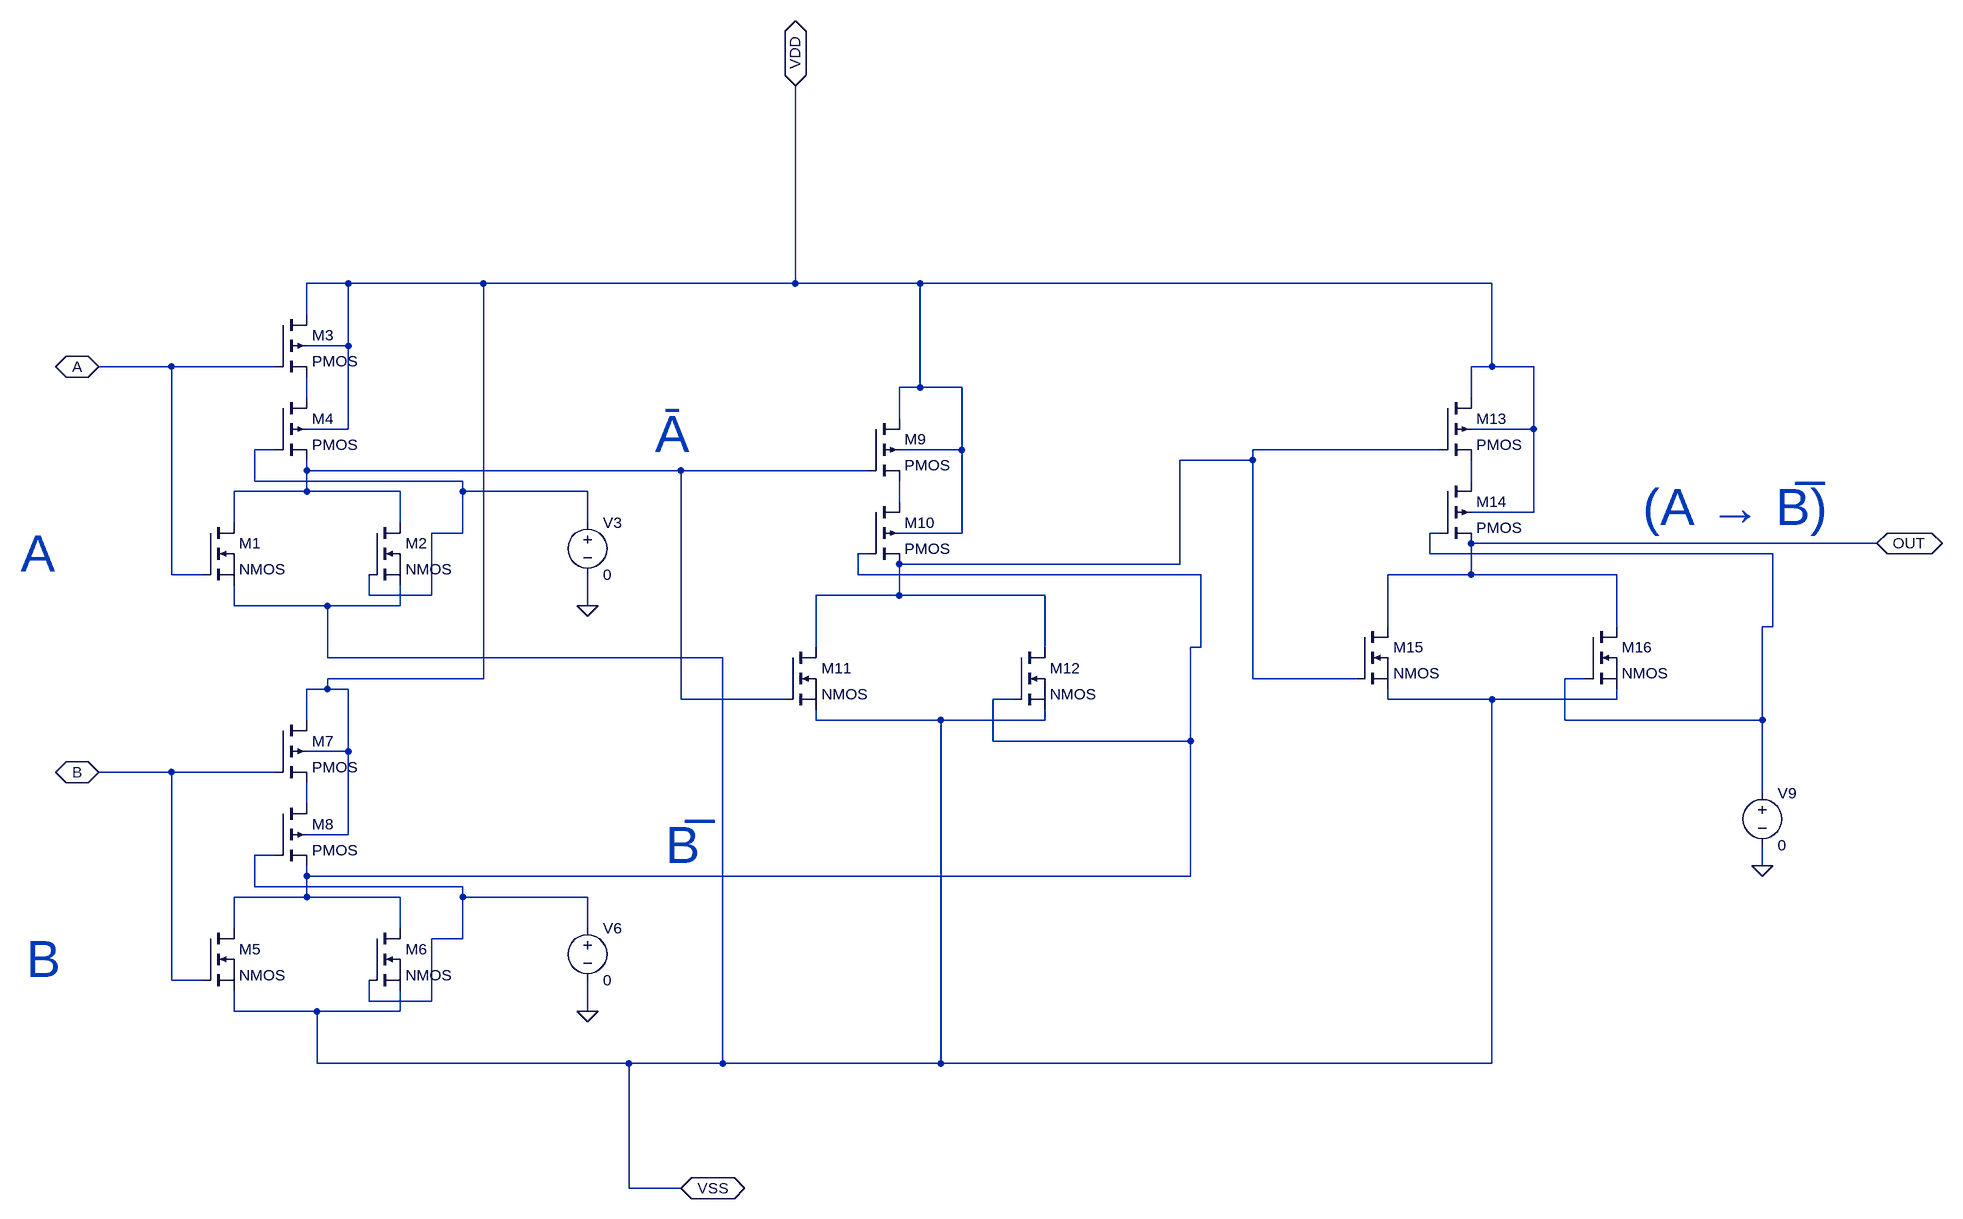
[diagram p0: schematic nandgateimply.asc]
nandgateimply.asc, the LTspice schematic file:
Version 4
SHEET 1 1692 1080
WIRE -768 -384 -832 -384
WIRE -560 -384 -768 -384
WIRE -80 -384 -80 -688
WIRE -80 -384 -560 -384
WIRE 112 -384 -80 -384
WIRE 992 -384 112 -384
WIRE -832 -336 -832 -384
WIRE -768 -288 -768 -384
WIRE -768 -288 -832 -288
WIRE -1040 -256 -1152 -256
WIRE -880 -256 -1040 -256
WIRE 992 -256 992 -384
WIRE 992 -256 960 -256
WIRE 1056 -256 992 -256
WIRE 112 -224 112 -384
WIRE 112 -224 80 -224
WIRE 176 -224 112 -224
WIRE -832 -208 -832 -240
WIRE 960 -208 960 -256
WIRE 80 -176 80 -224
WIRE -768 -160 -768 -288
WIRE -768 -160 -832 -160
WIRE 1056 -160 1056 -256
WIRE 1056 -160 960 -160
WIRE -880 -128 -912 -128
WIRE 176 -128 176 -224
WIRE 176 -128 80 -128
WIRE 912 -128 624 -128
WIRE 624 -112 624 -128
WIRE 624 -112 512 -112
WIRE -832 -96 -832 -112
WIRE -256 -96 -832 -96
WIRE 32 -96 -256 -96
WIRE -912 -80 -912 -128
WIRE -592 -80 -912 -80
WIRE 960 -80 960 -112
WIRE -832 -64 -832 -96
WIRE -832 -64 -944 -64
WIRE -688 -64 -832 -64
WIRE -592 -64 -592 -80
WIRE -400 -64 -592 -64
WIRE 80 -48 80 -80
WIRE 1056 -32 1056 -160
WIRE 1056 -32 960 -32
WIRE -944 -16 -944 -64
WIRE -688 -16 -688 -64
WIRE -400 -16 -400 -64
WIRE -592 0 -592 -64
WIRE -592 0 -640 0
WIRE 176 0 176 -128
WIRE 176 0 80 0
WIRE 912 0 896 0
WIRE 1584 16 960 16
WIRE 32 32 16 32
WIRE 896 32 896 0
WIRE 1424 32 896 32
WIRE 512 48 512 -112
WIRE 512 48 80 48
WIRE -1040 64 -1040 -256
WIRE -992 64 -1040 64
WIRE 16 64 16 32
WIRE 544 64 16 64
WIRE 960 64 960 16
WIRE 960 64 832 64
WIRE 1184 64 960 64
WIRE -736 96 -736 64
WIRE -640 96 -640 0
WIRE -640 96 -736 96
WIRE 80 96 80 48
WIRE 80 96 -48 96
WIRE 304 96 80 96
WIRE -944 112 -944 80
WIRE -800 112 -944 112
WIRE -688 112 -688 80
WIRE -688 112 -800 112
WIRE -400 112 -400 64
WIRE 832 144 832 64
WIRE 1184 144 1184 64
WIRE 1424 144 1424 32
WIRE 1424 144 1408 144
WIRE -48 176 -48 96
WIRE 304 176 304 96
WIRE 544 176 544 64
WIRE 544 176 528 176
WIRE -800 192 -800 112
WIRE -192 192 -800 192
WIRE -560 224 -560 -384
WIRE -560 224 -800 224
WIRE 624 224 624 -112
WIRE 784 224 624 224
WIRE 1136 224 1104 224
WIRE -800 240 -800 224
WIRE -800 240 -832 240
WIRE -768 240 -800 240
WIRE -256 256 -256 -96
WIRE -96 256 -256 256
WIRE 256 256 224 256
WIRE 832 256 832 240
WIRE 992 256 832 256
WIRE 1184 256 1184 240
WIRE 1184 256 992 256
WIRE -832 288 -832 240
WIRE -48 288 -48 272
WIRE 144 288 -48 288
WIRE 304 288 304 272
WIRE 304 288 144 288
WIRE 1104 288 1104 224
WIRE 1408 288 1408 144
WIRE 1408 288 1104 288
WIRE 224 320 224 256
WIRE 528 320 528 176
WIRE 528 320 224 320
WIRE -768 336 -768 240
WIRE -768 336 -832 336
WIRE -1040 368 -1152 368
WIRE -880 368 -1040 368
WIRE 1408 400 1408 288
WIRE -832 416 -832 384
WIRE -768 464 -768 336
WIRE -768 464 -832 464
WIRE -880 496 -912 496
WIRE 1408 512 1408 480
WIRE -832 528 -832 512
WIRE 528 528 528 320
WIRE 528 528 -832 528
WIRE -912 544 -912 496
WIRE -592 544 -912 544
WIRE -832 560 -832 528
WIRE -832 560 -944 560
WIRE -688 560 -832 560
WIRE -592 560 -592 544
WIRE -400 560 -592 560
WIRE -944 608 -944 560
WIRE -688 608 -688 560
WIRE -400 608 -400 560
WIRE -592 624 -592 560
WIRE -592 624 -640 624
WIRE -1040 688 -1040 368
WIRE -992 688 -1040 688
WIRE -736 720 -736 688
WIRE -640 720 -640 624
WIRE -640 720 -736 720
WIRE -944 736 -944 704
WIRE -816 736 -944 736
WIRE -688 736 -688 704
WIRE -688 736 -816 736
WIRE -400 736 -400 688
WIRE -816 816 -816 736
WIRE -336 816 -816 816
WIRE -192 816 -192 192
WIRE -192 816 -336 816
WIRE 144 816 144 288
WIRE 144 816 -192 816
WIRE 992 816 992 256
WIRE 992 816 144 816
WIRE -336 1008 -336 816
WIRE -256 1008 -336 1008
FLAG -400 112 0
FLAG -400 736 0
FLAG 1408 512 0
FLAG 1584 16 OUT
IOPIN 1584 16 BiDir
FLAG -256 1008 VSS
IOPIN -256 1008 BiDir
FLAG -80 -688 VDD
IOPIN -80 -688 BiDir
FLAG -1152 -256 A
IOPIN -1152 -256 BiDir
FLAG -1152 368 B
IOPIN -1152 368 BiDir
SYMBOL nmos -992 -16 R0
SYMATTR InstName M1
SYMBOL voltage -400 -32 R0
WINDOW 123 0 0 Left 0
WINDOW 39 0 0 Left 0
SYMATTR InstName V3
SYMATTR Value 0
SYMBOL nmos -736 -16 R0
SYMATTR InstName M2
SYMBOL pmos4 -880 -336 R0
SYMATTR InstName M3
SYMBOL pmos4 -880 -208 R0
SYMATTR InstName M4
SYMBOL nmos -992 608 R0
SYMATTR InstName M5
SYMBOL voltage -400 592 R0
WINDOW 123 0 0 Left 0
WINDOW 39 0 0 Left 0
SYMATTR InstName V6
SYMATTR Value 0
SYMBOL nmos -736 608 R0
SYMATTR InstName M6
SYMBOL pmos4 -880 288 R0
SYMATTR InstName M7
SYMBOL pmos4 -880 416 R0
SYMATTR InstName M8
SYMBOL pmos4 32 -176 R0
SYMATTR InstName M9
SYMBOL pmos4 32 -48 R0
SYMATTR InstName M10
SYMBOL nmos -96 176 R0
SYMATTR InstName M11
SYMBOL nmos 256 176 R0
SYMATTR InstName M12
SYMBOL pmos4 912 -208 R0
SYMATTR InstName M13
SYMBOL pmos4 912 -80 R0
SYMATTR InstName M14
SYMBOL nmos 784 144 R0
SYMATTR InstName M15
SYMBOL nmos 1136 144 R0
SYMATTR InstName M16
SYMBOL voltage 1408 384 R0
WINDOW 123 0 0 Left 0
WINDOW 39 0 0 Left 0
SYMATTR InstName V9
SYMATTR Value 0
TEXT -1272 32 Left 6 ;A
TEXT -1264 656 Left 6 ;B
TEXT -280 480 Left 6 ;B̅
TEXT -296 -152 Left 6 ;Ā
TEXT 1224 -40 Left 6 ;(A → B̅)

The netlist it stands for:
* nandgateimply.asc
M1 N004 A VSS VSS NMOS
V3 N002 0 0
M2 N004 N002 VSS VSS NMOS
M3 VDD A N001 VDD PMOS
M4 N001 N002 N004 VDD PMOS
M5 N008 B VSS VSS NMOS
V6 N010 0 0
M6 N008 N010 VSS VSS NMOS
M7 VDD B N009 VDD PMOS
M8 N009 N010 N008 VDD PMOS
M9 VDD N004 N006 VDD PMOS
M10 N006 N008 N003 VDD PMOS
M11 N003 N004 VSS VSS NMOS
M12 N003 N008 VSS VSS NMOS
M13 VDD N003 N005 VDD PMOS
M14 N005 N007 OUT VDD PMOS
M15 OUT N003 VSS VSS NMOS
M16 OUT N007 VSS VSS NMOS
V9 N007 0 0
.model NMOS NMOS
.model PMOS PMOS
.lib standard.mos
* A
* B
* B̅
* Ā
* (A → B̅)
.backanno
.end